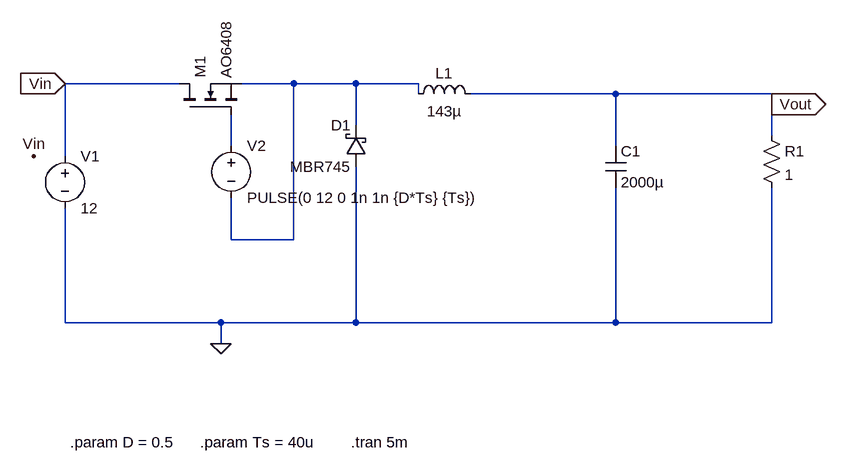
[diagram p0: schematic Buck converter.asc]
Buck converter.asc, the LTspice schematic file:
Version 4.1
SHEET 1 1224 680
WIRE -128 -800 -304 -800
WIRE 48 -800 -32 -800
WIRE 144 -800 48 -800
WIRE 240 -800 144 -800
WIRE 240 -784 240 -800
WIRE 544 -784 320 -784
WIRE 784 -784 544 -784
WIRE 784 -768 784 -784
WIRE 144 -736 144 -800
WIRE 784 -720 784 -768
WIRE -48 -704 -48 -752
WIRE 544 -704 544 -784
WIRE -304 -688 -304 -800
WIRE -48 -560 -48 -624
WIRE 48 -560 48 -800
WIRE 48 -560 -48 -560
WIRE -304 -432 -304 -608
WIRE -64 -432 -304 -432
WIRE 144 -432 144 -672
WIRE 144 -432 -64 -432
WIRE 544 -432 544 -640
WIRE 544 -432 144 -432
WIRE 784 -432 784 -640
WIRE 784 -432 544 -432
WIRE -64 -400 -64 -432
FLAG -64 -400 0
FLAG -304 -800 Vin
IOPIN -304 -800 In
FLAG 784 -768 Vout
IOPIN 784 -768 Out
FLAG -352 -688 Vin
SYMBOL voltage -304 -704 R0
WINDOW 123 0 0 Left 0
WINDOW 39 0 0 Left 0
SYMATTR InstName V1
SYMATTR Value 12
SYMBOL nmos -128 -752 R270
SYMATTR InstName M1
SYMATTR Value AO6408
SYMBOL ind 224 -768 R270
WINDOW 0 32 56 VTop 2
WINDOW 3 5 56 VBottom 2
SYMATTR InstName L1
SYMATTR Value 143µ
SYMATTR SpiceLine Rser=20m
SYMBOL cap 528 -704 R0
SYMATTR InstName C1
SYMATTR Value 2000µ
SYMATTR SpiceLine Rser=1m
SYMBOL res 768 -736 R0
SYMATTR InstName R1
SYMATTR Value 1
SYMBOL voltage -48 -720 R0
WINDOW 123 0 0 Left 0
WINDOW 39 0 0 Left 0
SYMATTR InstName V2
SYMATTR Value PULSE(0 12 0 1n 1n {D*Ts} {Ts})
SYMBOL schottky 160 -672 R180
WINDOW 0 24 64 Left 2
WINDOW 3 24 0 Left 2
SYMATTR InstName D1
SYMATTR Value MBR745
SYMATTR Description Diode
SYMATTR Type diode
TEXT -296 -248 Left 2 !.param D = 0.5
TEXT -96 -248 Left 2 !.param Ts = 40u
TEXT 136 -248 Left 2 !.tran 5m

The netlist it stands for:
* Buck converter.asc
V1 Vin 0 12
M1 Vin N002 N001 N001 AO6408
L1 N001 Vout 143µ Rser=20m
C1 Vout 0 2000µ Rser=1m
R1 Vout 0 1
V2 N002 N001 PULSE(0 12 0 1n 1n {D*Ts} {Ts})
D1 0 N001 MBR745
.model D D
.lib standard.dio
.model NMOS NMOS
.model PMOS PMOS
.lib standard.mos
.param D = 0.5
.param Ts = 40u
.tran 5m
.backanno
.end